# EAGLE design mainboard (EAGLE 5.11)
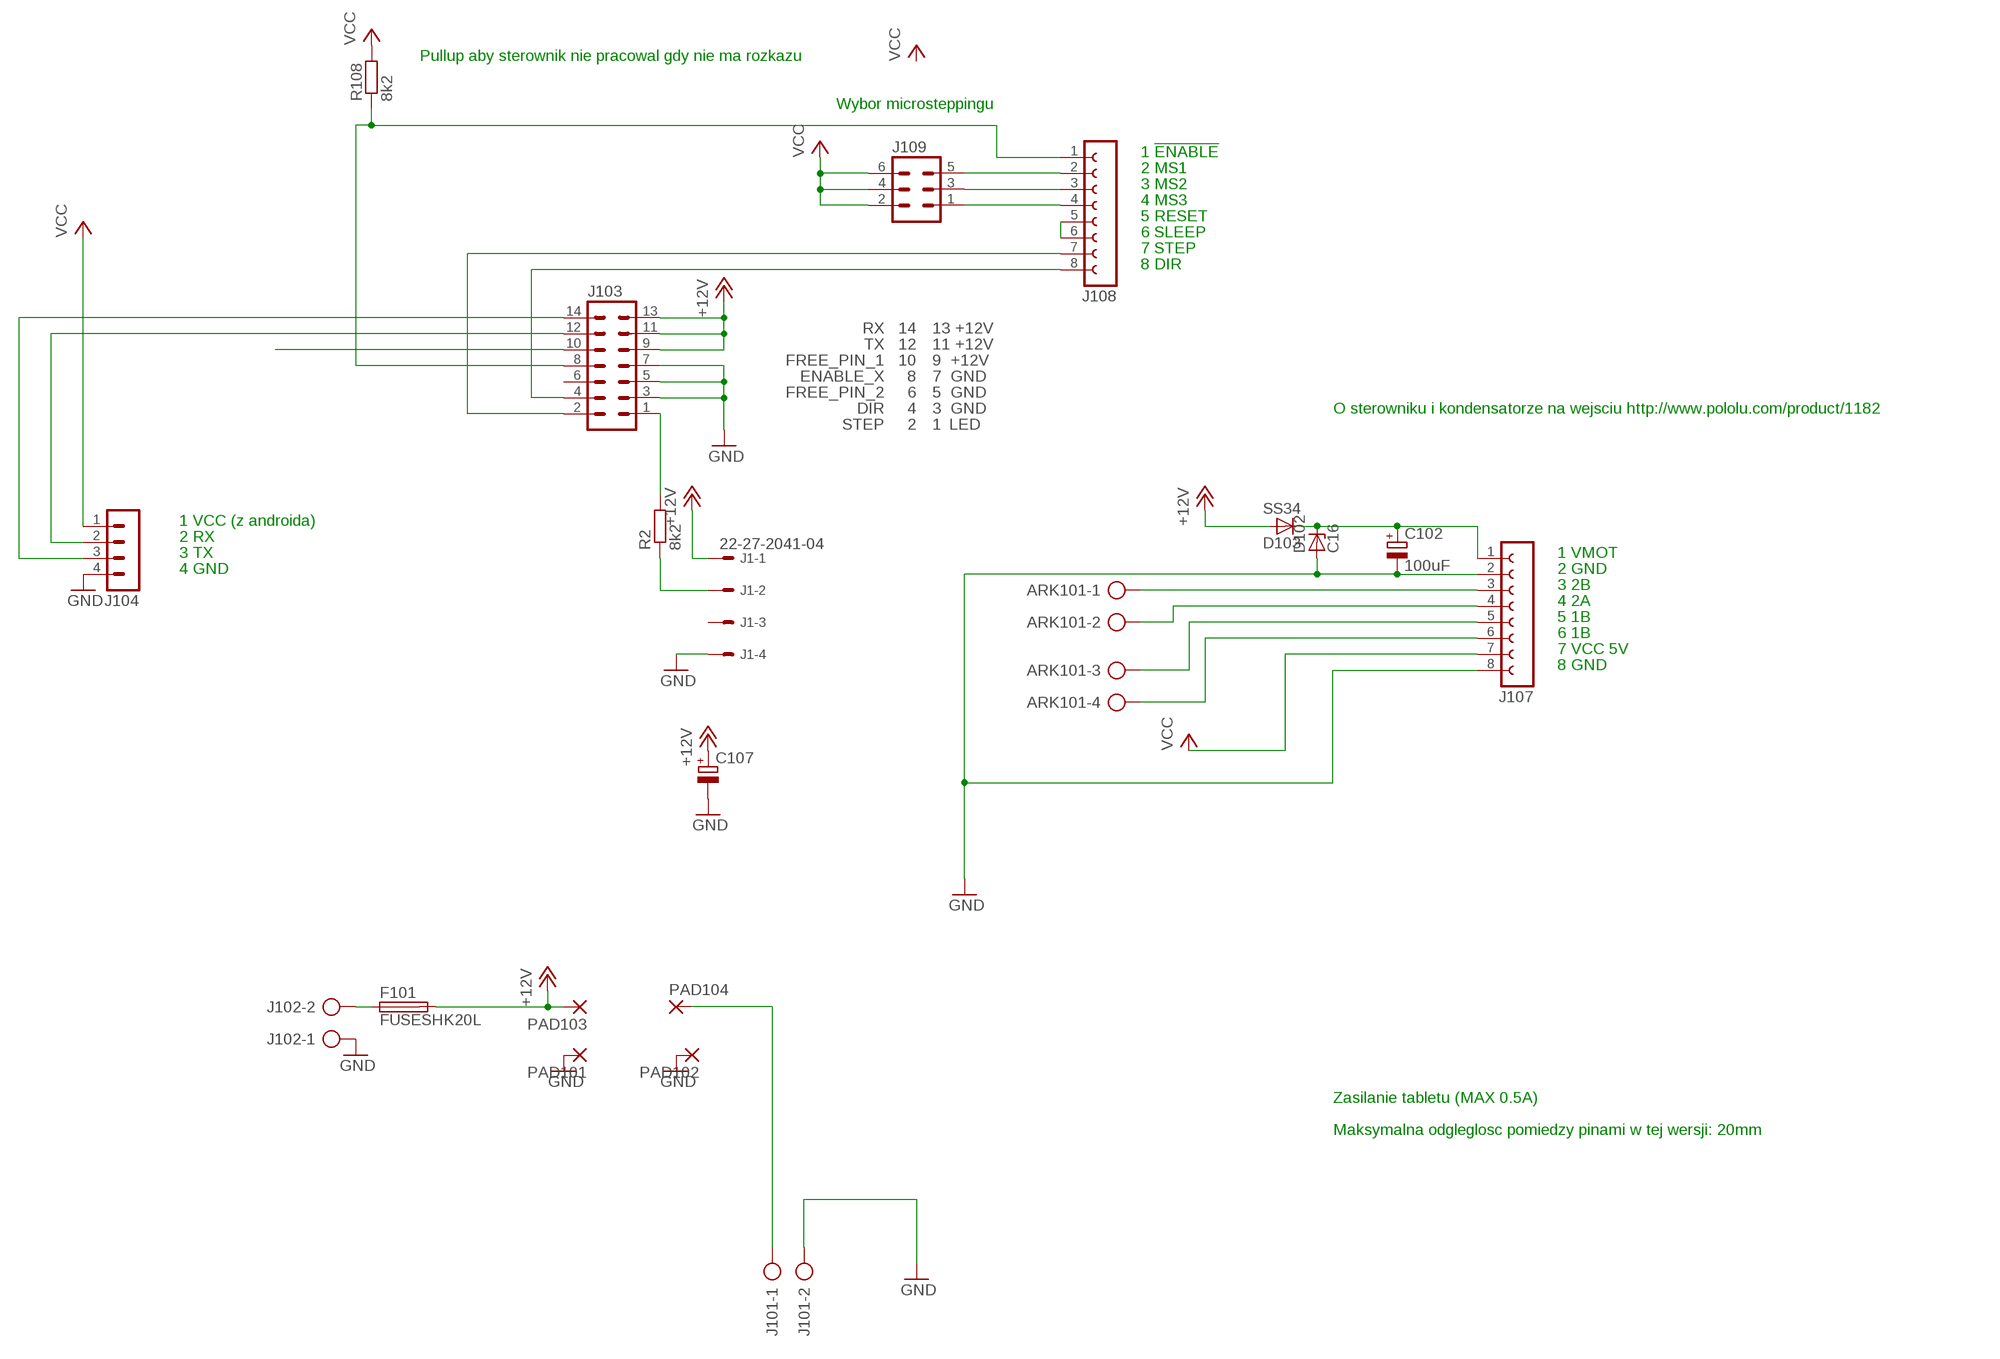
[diagram p0: schematic, sheet 1]

## Parts
ARK101  AK300/4  [AK300/4]
C102  100uF  CPOL-EUE5-10.5  [E5-10,5]
C107  CPOL-EUE5-8.5  [E5-8,5]
D102  C16  ZENER-DIODESOD80C  [SOD80C]
D103  SS34  BYS10  [SOD106A]
F101  FUSESHK20L  [SHK20L]
J1  22-27-2041-04  [6410-04]
J101  AK300/2  [AK300/2]
J102  AK300/2  [AK300/2]
J103  ML14  [ML14]
J104  MA04-1  [MA04-1]
J107  FE08-1  [FE08]
J108  FE08-1  [FE08]
J109  MA03-2  [MA03-2]
PAD101  3,17/1,1  [3,17/1,1]
PAD102  3,17/1,1  [3,17/1,1]
PAD103  3,17/1,1  [3,17/1,1]
PAD104  3,17/1,1  [3,17/1,1]
R2  8k2  RES0805  [0805]
R108  8k2  RES0805  [0805]

## Nets
+12V [VCC12V]: C107.+ D103.A F101.2A J1.1 J103.9 J103.11 J103.13 PAD103.1(P)
GND [Ground]: C102.- C107.- D102.A J1.4 J101.2 J102.1 J103.3 J103.5 J103.7 J104.4 J107.2 J107.8 PAD101.1(P) PAD102.1(P)
JUMPER101: J103.8 J108.1 R108.1
MISO: J103.4 J108.8
N$1: J103.1 R2.2
N$2: J101.1 PAD104.1(P)
N$3: J103.2 J108.7
N$4: J1.2 R2.1
N$5: J103.10
N$16: F101.1A J102.2
N$17: ARK101.1 J107.3
N$18: ARK101.2 J107.4
N$19: ARK101.3 J107.5
N$20: ARK101.4 J107.6
N$24: J108.5 J108.6
N$35: J108.2 J109.5
N$39: J108.3 J109.3
N$40: J108.4 J109.1
N$43 [VCC12V]: C102.+ D102.C D103.K J107.1
SCL: J103.12 J104.2
SDA: J103.14 J104.3
VCC: J104.1 J107.7 J109.2 J109.4 J109.6 R108.2
Unconnected: J1.3 J103.6

## Notes on the sheet
- Pullup aby sterownik nie pracowal gdy nie ma rozkazu
- Wybor microsteppingu
- 1 !ENABLE
- 2 MS1
- 3 MS2
- 4 MS3
- 5 RESET
- 6 SLEEP
- 7 STEP
- 8 DIR
- RX | 14 | 13 +12V
- TX | 12 | 11 +12V
- FREE_PIN_1 | 10 | 9  +12V
- ENABLE_X | 8 | 7  GND
- FREE_PIN_2 | 6 | 5  GND
- DIR | 4 | 3  GND | O sterowniku i kondensatorze na wejsciu http://www.pololu.com/product/1182
- STEP | 2 | 1 | LED
- 1 VCC (z androida)
- 2 RX
- 3 TX | 1 VMOT
- 4 GND | 2 GND
- 3 2B
- 4 2A
- 5 1B
- 6 1B
- 7 VCC 5V
- 8 GND
- Zasilanie tabletu (MAX 0.5A)
- Maksymalna odgleglosc pomiedzy pinami w tej wersji: 20mm

## Library data of the parts
ARK101 = con-ptr500:AK300/4: CONNECTOR
C102 C107 = rcl:CPOL-EU: POLARIZED CAPACITOR, European symbol
D102 = diode:ZENER-DIODE: Z-Diode
D103 = telefunken:BYS10: DIODE
F101 = fuse:FUSE: Fuse
J1 = con-molex:22-?-04: CONNECTOR wire to board 2.54 mm (.1 inch) pitch header
J101 J102 = con-ptr500:AK300/2: CONNECTOR
J103 = con-ml:ML14: HARTING
J104 = con-lstb:MA04-1: PIN HEADER
J107 J108 = con-lsta:FE08-1: FEMALE HEADER
J109 = con-lstb:MA03-2: PIN HEADER
PAD101-PAD104 = wirepad:3,17/1,1: THROUGH-HOLE PAD
R2 R108 = barobot:RES

## Net classes
0 default: width 0.381 mm
1 VCC12V: width 1.27 mm, drill 1.27 mm, clearance 0.508 mm
2 Ground: width 0.508 mm, drill 0.508 mm

## Board
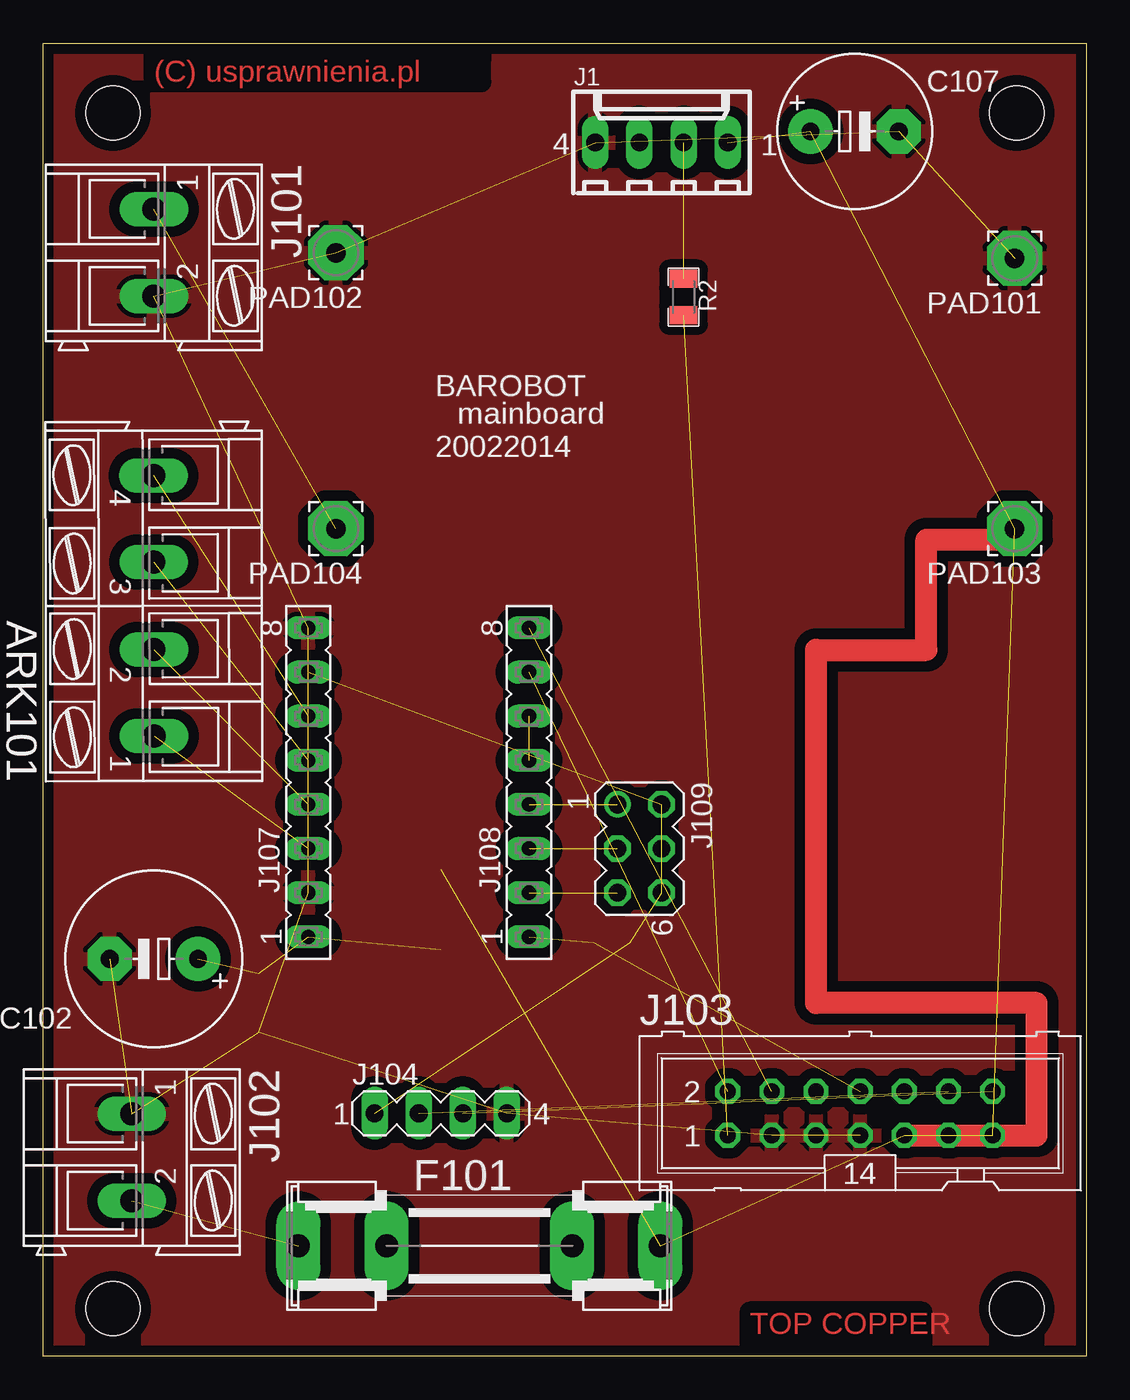
[diagram p1: board, top side]
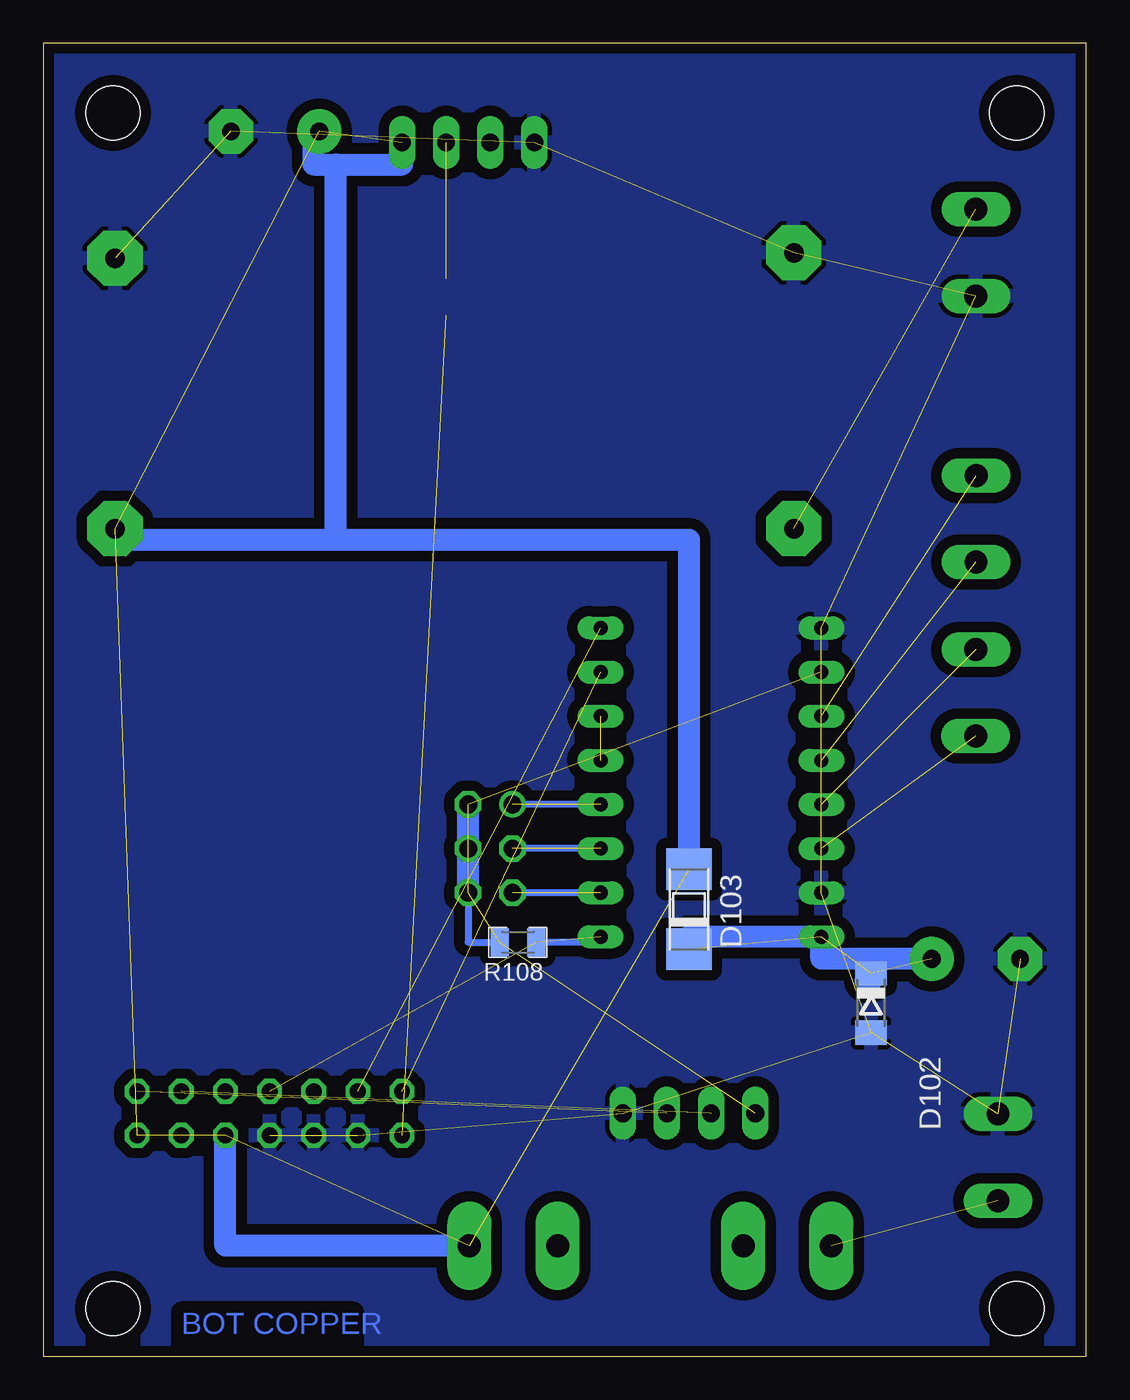
[diagram p2: board, bottom side, seen from below]

Size 60 x 75.55 mm. Coordinates in mm from the lower left corner, seen from the top.
Outline: 0,0 0,75.55 60,75.55 60,0 0,0
Copper layers (1*16): Top 0.035mm / dielectric 1.5mm / Bottom 0.035mm
Design rules "default *": minimum track width 10mil, minimum drill 0.5mm, track to track 8mil, track to pad 8mil, pad to pad 8mil, via to via 8mil, smd to smd 8mil, copper to edge 20mil, drill to drill 8mil, minimum pad ring 10mil, minimum via ring 8mil, stop-mask expansion 4mil, vias tented up to drill 0mil, thermal gap 10mil
Holes 3.1 mm at 4,2.73 56,2.73 56,71.55 4,71.55

### Footprints (pad centres in the part's own frame; a part is rotated, then mirrored left to right if it is on the bottom)
AK300/4 = drill 1.321 long: 1 -7.493,0; 2 -2.515,0; 3 2.515,0; 4 7.493,0
E5-10,5 = drill 1.016 pad 2.54 round: + -2.54,0 | drill 1.016 pad 2.54 octagon: - 2.54,0
E5-8,5 = drill 1.016 pad 2.54 round: + -2.54,0 | drill 1.016 pad 2.54 octagon: - 2.54,0
SOD80C = smd 1.4 x 1.8: A 1.7,0; C -1.7,0
SOD106A = smd 2.4 x 2.6: A 2.3,0; K -2.3,0
SHK20L = drill 1.321 pad 2.54 long: 1A -10.414,0; 1B -5.334,0; 2A 10.414,0; 2B 5.334,0
6410-04 = drill 1.016 long: 1 3.81,0; 2 1.27,0; 3 -1.27,0; 4 -3.81,0
AK300/2 = drill 1.321 long: 1 -2.515,0; 2 2.489,0
ML14 = drill 0.914 octagon: 1 -7.62,-1.27; 2 -7.62,1.27; 3 -5.08,-1.27; 4 -5.08,1.27; 5 -2.54,-1.27; 6 -2.54,1.27; 7 0,-1.27; 8 0,1.27; 9 2.54,-1.27; 10 2.54,1.27; 11 5.08,-1.27; 12 5.08,1.27; 13 7.62,-1.27; 14 7.62,1.27
MA04-1 = drill 1.016 long: 1 -3.81,0; 2 -1.27,0; 3 1.27,0; 4 3.81,0
FE08 = drill 0.813 long: 1 -8.89,0; 2 -6.35,0; 3 -3.81,0; 4 -1.27,0; 5 1.27,0; 6 3.81,0; 7 6.35,0; 8 8.89,0
MA03-2 = drill 1.016 round: 1 -2.54,-1.27 | drill 1.016 octagon: 2 -2.54,1.27; 3 0,-1.27; 4 0,1.27; 5 2.54,-1.27; 6 2.54,1.27
3,17/1,1 = drill 1.118 pad 3.175 octagon: 1 0,0
0805 = smd 1.044 x 1.6: 1 -1.048,0; 2 1.048,0

### Placement (x,y rotation side)
ARK101  6.35,43.18 90.1 top
C102  6.35,22.86 180 top
C107  46.67,70.48 0 top
D102  12.38,20.32 270 bottom
D103  22.86,25.72 90 bottom
F101  25.08,6.35 0 top
J1  35.56,69.85 0 top
J101  6.35,63.5 270 top
J102  5.08,11.43 270 top
J103  46.99,13.97 0 top
J104  22.86,13.97 0 top
J107  15.24,33.02 90 top
J108  27.94,33.02 90 top
J109  34.29,29.21 270 top
PAD101  55.88,63.18 180 top
PAD102  16.83,63.5 180 top
PAD103  55.88,47.62 180 top
PAD104  16.83,47.62 180 top
R2  36.83,60.96 270 top
R108  32.7,23.81 180 bottom

### Tracks (layer width: path | path; a pad name or v marks a point on that pad's centre or on a via)
+12V  (7 unrouted)
  Top 1.27: J103.9 J103.11 J103.13 57.15,12.7 57.15,20.32 44.45,20.32 44.45,40.64 50.8,40.64 50.8,46.99 55.88,46.99 PAD103.1
  Bottom 1.27: J103.9 49.53,6.35 F101.2A | J1.1 39.37,68.58 43.18,68.58 | 43.18,68.58 44.45,68.58 44.45,69.85 44.13,69.85 C107.+ | 43.18,46.99 55.88,46.99 PAD103.1 | 43.18,46.99 22.86,46.99 D103.A | 43.18,46.99 43.18,68.58
GND  (13 unrouted)
  pour Top (isolate 0.61): 0,74.93 59.69,74.93 59.69,0 0,0
  pour Bottom (isolate 0.61): 0,76.2 59.69,76.2 59.69,0 0,0
JUMPER101  (2 unrouted)
  Bottom 0.406: R108.1 27.94,23.81 J108.1
MISO  (1 unrouted)
N$1  (1 unrouted)
N$2  (1 unrouted)
N$3  (1 unrouted)
N$4  (1 unrouted)
N$16  (1 unrouted)
N$17  (1 unrouted)
N$18  (1 unrouted)
N$19  (1 unrouted)
N$20  (1 unrouted)
N$24  (1 unrouted)
N$35  (1 unrouted)
  Bottom 0.406: J108.2 J109.5
N$39  (1 unrouted)
  Bottom 0.406: J108.3 J109.3
N$40  (1 unrouted)
  Bottom 0.406: J108.4 J109.1
N$43  (3 unrouted)
  Bottom 1.27: C102.+ 12.7,22.86 | 12.7,22.86 15.24,22.86 J107.1 22.86,24.13 D103.K | 12.7,22.86 12.7,21.59 12.38,21.59 D102.C
SCL  (1 unrouted)
SDA  (1 unrouted)
VCC  (5 unrouted)
  Bottom 0.406: R108.2 35.56,23.81 J109.6
  Bottom 1.27: J109.2 J109.4 J109.6

### Text on the board
Top: (C) usprawnienia.pl | BAROBOT | mainboard | 20022014 | TOP COPPER
Bottom: BOT COPPER
tPlace: BAROBOT | mainboard | 20022014